# Altium schematic sheet DONGLE02.SchDoc
size A4; SheetNumber: 1; SheetTotal: 1
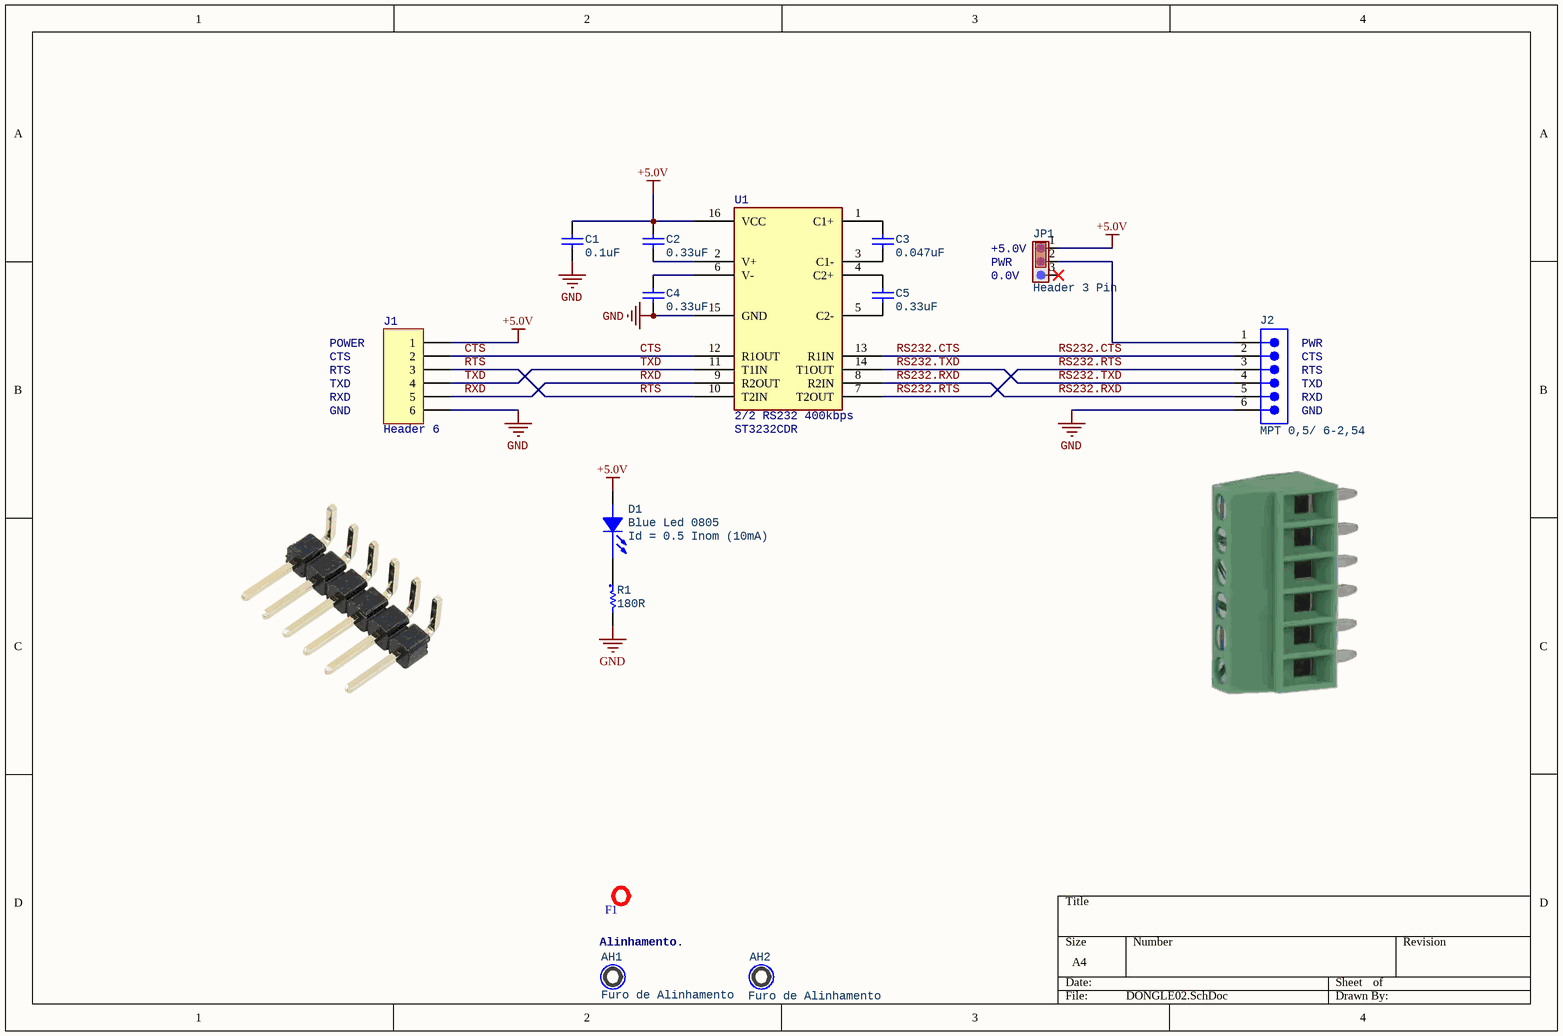
[diagram p0: DONGLE02.SchDoc]

## Parts
AH1  Furo de Alinhamento  [AH_2.0MMD]  (no BOM)
AH2  Furo de Alinhamento  [AH_2.0MMD]  (no BOM)
C1  0.1uF  [C0805]
C2  0.33uF  [C0805]
C3  0.047uF  [C0805]
C4  0.33uF  [C0805]
C5  0.33uF  [C0805]
D1  Blue Led 0805  Info: Id = 0.5 Inom (10mA)  [LED 0805]
F1  (no value)  [FIDUCIAL]  (no BOM)
J1  Header 6  [BERG-M-6V-H-INV]
J2  MPT 0,5/ 6-2,54  [1725698]
JP1  Header 3 Pin  [JMP-3-PTH-180]  (no BOM)
R1  180R  [R0805]
U1  2/2 RS232 400kbps  Manufacturer P/N: ST3232CDR  [SOIC16N]

## Nets
+5.0V: C1.1 C2.1 D1.A J1.1 JP1.1 U1.16(VCC)
GND: C1.2 C4.2 J1.6 J2.6 R1.2 U1.15(GND)
CTS: J1.2 U1.12(R1OUT)
RS232.CTS: J2.2 U1.13(R1IN)
RS232.RTS: J2.3 U1.7(T2OUT)
RS232.RXD: J2.5 U1.8(R2IN)
RS232.TXD: J2.4 U1.14(T1OUT)
RTS: J1.3 U1.10(T2IN)
RXD: J1.5 U1.9(R2OUT)
TXD: J1.4 U1.11(T1IN)
NetC2_2: C2.2 U1.2(V+)
NetC3_1: C3.1 U1.1(C1+)
NetC3_2: C3.2 U1.3(C1-)
NetC4_1: C4.1 U1.6(V-)
NetC5_1: C5.1 U1.4(C2+)
NetC5_2: C5.2 U1.5(C2-)
NetD1_K: D1.K R1.1
NetJ2_1: J2.1 JP1.2

Not connected (* = marked no-connect by the designer): JP1 3*

## Notes on the sheet
- (near JP1) +5.0V
- (near JP1) PWR
- (near JP1) 0.0V
- POWER
- CTS
- TXD
- RTS
- (near J2) PWR
- (near J2) CTS
- (near J2) RTS
- (near J2) TXD
- RXD
- GND
- (near J2) RXD
- (near J2) GND
- Alinhamento.

## Library data of the parts
AH1 AH2 = Aligment Hole M2: RefDes: RefDes; Supplier: Digikey
C1 = CAP: 0.1 µF ±10% 100V Ceramic Capacitor X7R 0805 (2012 Metric); Manufacturer: Murata Electronics; Manufacturer P/N: GCM21BR72A104KA37L; Info: MLCC; Supplier: Digikey; Supplier P/N (Tape & Reel): 490-4789-2-ND; Value: 0.1uF; Supplier P/N (Cut Tape): 490-4789-1-ND; Datasheet Web: https://search.murata.co.jp/Ceramy/image/img/A01X/G101/ENG/GCM033R71A103KA03-01A.pdf; RefDes: RefDes; Supplier Web: https://www.digikey.com/en/products/detail/murata-electronics/GCM21BR72A104KA37L/1641663?s=N4IgTCBcDaIOIGECyYCMAhASgdjAQVQAYAWAaTwGZsAZEAXQF8g
C2 C4 C5 = CAP: 0.33 µF ±5% 25V Ceramic Capacitor X7R 0805 (2012 Metric); Manufacturer: KEMET; Manufacturer P/N: C0805C334J3RECAUTO7210; Info: MLCC; Supplier: Digikey; Supplier P/N (Tape & Reel): 399-C0805C334J3RECAUTO7210TR-ND; Value: 0.33uF; Supplier P/N (Cut Tape): 399-C0805C334J3RECAUTO7210CT-ND; Datasheet Web: https://content.kemet.com/datasheets/KEM_C1090_X7R_ESD.pdf; RefDes: RefDes; Supplier Web: https://www.digikey.com/en/products/detail/kemet/C0805C334J3RECAUTO7210/8647991
C3 = CAP: 0.047 µF ±5% 25V Ceramic Capacitor X7R 0805 (2012 Metric); Manufacturer: KYOCERA AVX; Manufacturer P/N: KGM21NR71E473JT; Info: MLCC; Supplier: Digikey; Supplier P/N (Tape & Reel): 478-KGM21NR71E473JTTR-ND; Value: 0.047uF; Supplier P/N (Cut Tape): 478-KGM21NR71E473JTCT-ND; Datasheet Web: https://datasheets.kyocera-avx.com/KGM_X7R.pdf; RefDes: RefDes; Supplier Web: https://www.digikey.com/en/products/detail/kyocera-avx/KGM21NR71E473JT/1602247
D1 = LED GREEN 0805: Blue 470nm LED Indication - Discrete 3.2V 0805 (2012 Metric); Manufacturer: Würth Elektronik; Manufacturer P/N: 150080BS75000; RefDes: RefDes; Value: Blue Led 0805; Supplier Web: https://www.digikey.com/en/products/detail/w%C3%BCrth-elektronik/150080BS75000/4489912; Supplier P/N (Tape & Reel): 732-4982-2-ND; Supplier P/N (Cut Tape): 732-4982-1-ND; Supplier: Digikey; Datasheet Web: https://www.we-online.com/components/products/datasheet/150080BS75000.pdf
F1 = FIDUCIAL: FIDUCIAL MARK; RefDes: rRefDes; Supplier: Digikey
J1 = Header 6: Connector Header Through Hole, Right Angle 6 position 0.100" (2.54mm); Manufacturer: Adam Tech; Manufacturer P/N: PH1RB-06-UA; Info: CONN HEADER R/A 6POS 2.54MM; Value: 1x6 0.1" Right Angle Pin Header; Datasheet Web: https://app.adam-tech.com/products/download/data_sheet/201281/ph1rb-xx-ua-data-sheet.pdf; RefDes: RefDes; Supplier: Digikey; Supplier P/N (Cut Tape): 2057-PH1RB-06-UA-ND; Supplier P/N (Tape & Reel): 2057-PH1RB-06-UA-ND; Supplier Web: https://www.digikey.com/en/products/detail/adam-tech/PH1RB-06-UA/9830592
J2 = 691322110006: 6 Position Wire to Board Terminal Block Horizontal with Board 0.100" (2.54mm) Through Hole; Manufacturer: Phoenix Contact; Info: Borne 6pos 6A e=2,54; Manufacturer P/N: 1725698; Supplier: Digikey; Supplier P/N (Tape & Reel): 277-1277-ND; Value: MPT 0,5/ 6-2,54; Datasheet Web: https://www.phoenixcontact.com/en-us/products/printed-circuit-board-terminal-mpt-05-6-254-1725698?type=pdf; Supplier P/N (Cut Tape): 277-1277-ND; RefDes: RefDes; Supplier Web: https://www.digikey.com/en/products/detail/phoenix-contact/1725698/267466
JP1 = Jumper 3: 3 Pin Jumper; Manufacturer P/N: 61300311121; Manufacturer: Würth Elektronik; Info: 0.1" Pin header 1x3; RefDes: RefDes; Value: Header 3 Pin; Supplier Web: https://www.digikey.com/en/products/detail/w%C3%BCrth-elektronik/61300311121/4846825; Supplier P/N (Tape & Reel): 732-5316-ND; Supplier P/N (Cut Tape): 732-5316-ND; Supplier: Digikey; Datasheet Web: https://www.we-online.com/components/products/datasheet/61300311121.pdf
R1 = RESISTOR: 180 Ohms ±1% 0.25W, 1/4W Chip Resistor 0805 (2012 Metric) Anti-Sulfur Thin Film; Manufacturer: Stackpole Electronics Inc; Manufacturer P/N: RNCP0805FTD180R; Info: 1% 100 PPM; RefDes: RefDes; Supplier: Digikey; Supplier P/N (Tape & Reel): RNCP0805FTD180RTR-ND; Value: 180R; Datasheet Web: https://www.seielect.com/catalog/sei-rncp.pdf; Supplier P/N (Cut Tape): RNCP0805FTD180RCT-ND; Supplier Web: https://www.digikey.com/en/products/detail/stackpole-electronics-inc/RNCP0805FTD180R/2240212
U1 = CI SMD ST3232CDR-SO16: 2/2 Transceiver Full RS232 16-SO; Manufacturer: STMicroelectronics; Info: ST3232CDR; RefDes: RefDes; Value: 2/2 RS232 400kbps; Supplier Web: https://www.digikey.com/en/products/detail/stmicroelectronics/ST3232CDR/686410?s=N4IgTCBcDaIMoBUDMYUGEAiAlEBdAvkA; Supplier P/N (Tape & Reel): 497-3731-2-ND; Supplier P/N (Cut Tape): 497-3731-1-ND; Supplier: Digikey; Datasheet Web: https://www.st.com/content/ccc/resource/technical/document/datasheet/group1/40/2c/7f/62/3a/3f/47/3c/CD00002253/files/CD00002253.pdf/jcr:content/translations/en.CD00002253.pdf